# Altium schematic sheet SPK_N.SchDoc
size A; SheetNumber: 6; SheetTotal: 6; SPICEModelCacheWYKAUUDH: <root> / <DocumentId>WYKAUUDH</DocumentId> / <CacheFrame Number="0"> / <Model Name="2n3904" Kind="MDL"> / <Text>*2N3904 / *Si 310mW  40V 200mA 300MHz pkg:TO-92B 1,2,3 / .MODEL 2N3904 NPN(IS=1.4E-14 BF=300 VAF=100 IKF=0.025 ISE=3E-13 / + BR=7.5 RC=2.4 CJE=4.5E-12 TF=4E-10 CJC=3.5E-12 TR=2.1E-8 XTB=1.5 KF=9E-16 )</Text> / </Model> / <Model Name="2n3906" Kind="MDL"> / <Text>*2N3906 / *Si 310mW  40V 200mA 250MHz pkg:TO-92B 1,2,3 / .MODEL 2N3906 PNP(IS=4E-14 BF=400 VAF=50 IKF=0.02 ISE=7E-15 NE=1.16 / + BR=7.5 RC=2.4 CJE=6.3E-12 VJE=0.75 TF=5E-10 CJC=5.8E-12 VJC=0.75 TR=2.3E-8 / + VJS=0.75 XTB=1.5 KF=6E-16 )</Text> / </Model> / </CacheFrame> / </root>
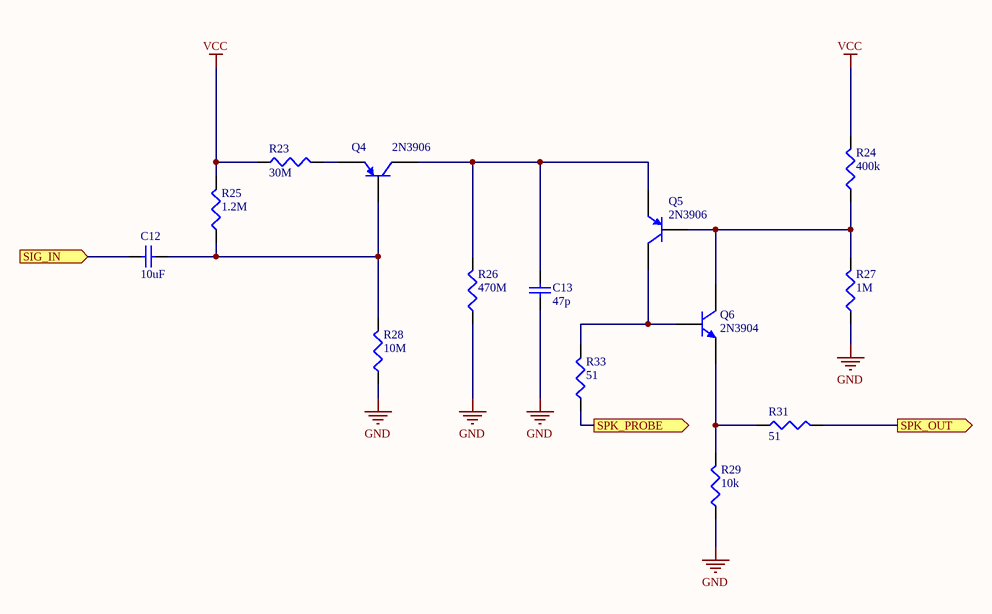
[diagram p0: SPK_N.SchDoc]

## Parts
C12  10uF  [SMD-0603]
C13  47p  [SMD-0603]
Q4  2N3906  [TO-92A]
Q5  2N3906  [TO-92A]
Q6  2N3904  [TO-92A]
R23  30M  [SMD-0603]
R24  400k  [SMD-0603]
R25  1.2M  [SMD-0603]
R26  470M  [SMD-0603]
R27  1M  [SMD-0603]
R28  10M  [SMD-0603]
R29  10k  [SMD-0603]
R31  51  [SMD-0603]
R33  51  [SMD-0603]

## Ports
SIG_IN (in), SPK_OUT (out), SPK_PROBE (out)

## Nets
GND: C13.1 R26.1 R27.1 R28.1 R29.1
VCC: R23.1 R24.2 R25.2
SIG_IN: C12.1 ; port SIG_IN
SPK_OUT: R31.2 ; port SPK_OUT
SPK_PROBE: R33.1 ; port SPK_PROBE
NetC12_2: C12.2 Q4.2(B) R25.1 R28.2
NetC13_2: C13.2 Q4.3(C) Q5.1(E) R26.2
NetQ4_1: Q4.1(E) R23.2
NetQ5_2: Q5.2(B) Q6.3(C) R24.1 R27.2
NetQ5_3: Q5.3(C) Q6.2(B) R33.2
NetQ6_1: Q6.1(E) R29.2 R31.1

## Library data of the parts
C12 C13 = CAP0603: Ceramic Capacitor 0603
Q4 Q5 = 2N3906: PNP General Purpose Amplifier; Published: 8-Jun-2000; LatestRevisionDate: 15-Jan-2003; LatestRevisionNote: PCB Footprint 'BCY-W3/D4.7' replaced; DatasheetVersion: 1997; PackageVersion: Sep-1998; PackageReference: TO-92A; Publisher: Altium Limited; PackageDescription: TO, Flat Index; 3 In-Line, Axial Leads; Body Dia. 4.5mm; Leads 0.51 x 0.48 mm (max); ComponentLink1Description: Manufacturer Link; ComponentLink1URL: http://www.fairchildsemi.com/; ComponentLink2Description: Datasheet; ComponentLink2URL: http://www.fairchildsemi.com/ds/2N%2F2N3906.pdf
Q6 = 2N3904: NPN General Purpose Amplifier; Published: 8-Jun-2000; LatestRevisionDate: 15-Jan-2003; LatestRevisionNote: PCB Footprint 'BCY-W3/D4.7' replaced; DatasheetVersion: 1997; PackageVersion: Sep-1998; PackageReference: TO-92A; Publisher: Altium Limited; PackageDescription: TO, Flat Index; 3 In-Line, Axial Leads; Body Dia. 4.5mm; Leads 0.51 x 0.48 mm (max); ComponentLink1Description: Manufacturer Link; ComponentLink1URL: http://www.fairchildsemi.com/; ComponentLink2Description: Datasheet; ComponentLink2URL: http://www.fairchildsemi.com/ds/2N%2F2N3904.pdf
R23-R29 R31 R33 = RES0603: Resistor-0603